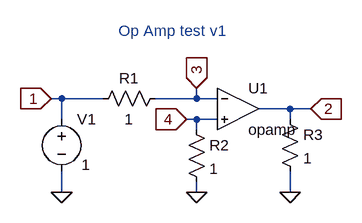
[diagram p0: schematic op-amp-test-v1.asc]
op-amp-test-v1.asc, the LTspice schematic file:
Version 4
SHEET 1 880 680
WIRE 96 80 80 80
WIRE 160 80 96 80
WIRE 304 80 304 64
WIRE 304 80 240 80
WIRE 336 80 304 80
WIRE 448 96 400 96
WIRE 480 96 448 96
WIRE 96 112 96 80
WIRE 304 112 288 112
WIRE 336 112 304 112
WIRE 448 112 448 96
WIRE 304 128 304 112
WIRE 96 224 96 192
WIRE 304 224 304 208
WIRE 448 224 448 192
FLAG 304 224 0
FLAG 96 224 0
FLAG 80 80 1
IOPIN 80 80 In
FLAG 480 96 2
IOPIN 480 96 In
FLAG 288 112 4
IOPIN 288 112 In
FLAG 448 224 0
FLAG 304 64 3
IOPIN 304 64 In
SYMBOL voltage 96 96 R0
WINDOW 123 29 90 Left 2
WINDOW 39 0 0 Left 0
WINDOW 3 31 86 Left 2
SYMATTR Value 1
SYMATTR InstName V1
SYMBOL OpAmps\\opamp 368 32 R0
SYMATTR InstName U1
SYMBOL res 256 64 R90
WINDOW 0 0 56 VBottom 2
WINDOW 3 32 56 VTop 2
SYMATTR InstName R1
SYMATTR Value 1
SYMBOL res 432 96 R0
SYMATTR InstName R3
SYMATTR Value 1
SYMBOL res 288 112 R0
SYMATTR InstName R2
SYMATTR Value 1
TEXT 184 -24 Left 2 ;Op Amp test v1

The netlist it stands for:
* op-amp-test-v1.asc
V1 1 0 1
XU1 3 4 2 opamp Aol=100K GBW=10Meg  ; pins invin noninvin out
R1 3 1 1
R3 2 0 1
R2 4 0 1
* Op Amp test v1
.backanno
.end